# Altium schematic sheet MCU.SchDoc
size A3; PageSetup: Record=PageOptions|CenterHorizontal=True|CenterVertical=True|PrintScale=0.73|XCorrection=1.00|YCorrection=1.00|PrintKind=0|BorderSize=5000000|LeftOffset=0|BottomOffset=0|Orientation=2|PaperLength=1000|PaperWidth=1000|Scale=100|PaperSource=7|PrintQuality=-3|MediaType=1|DitherType=10|PrintScaleMode=1|PaperKind=A4|PaperIndex=9
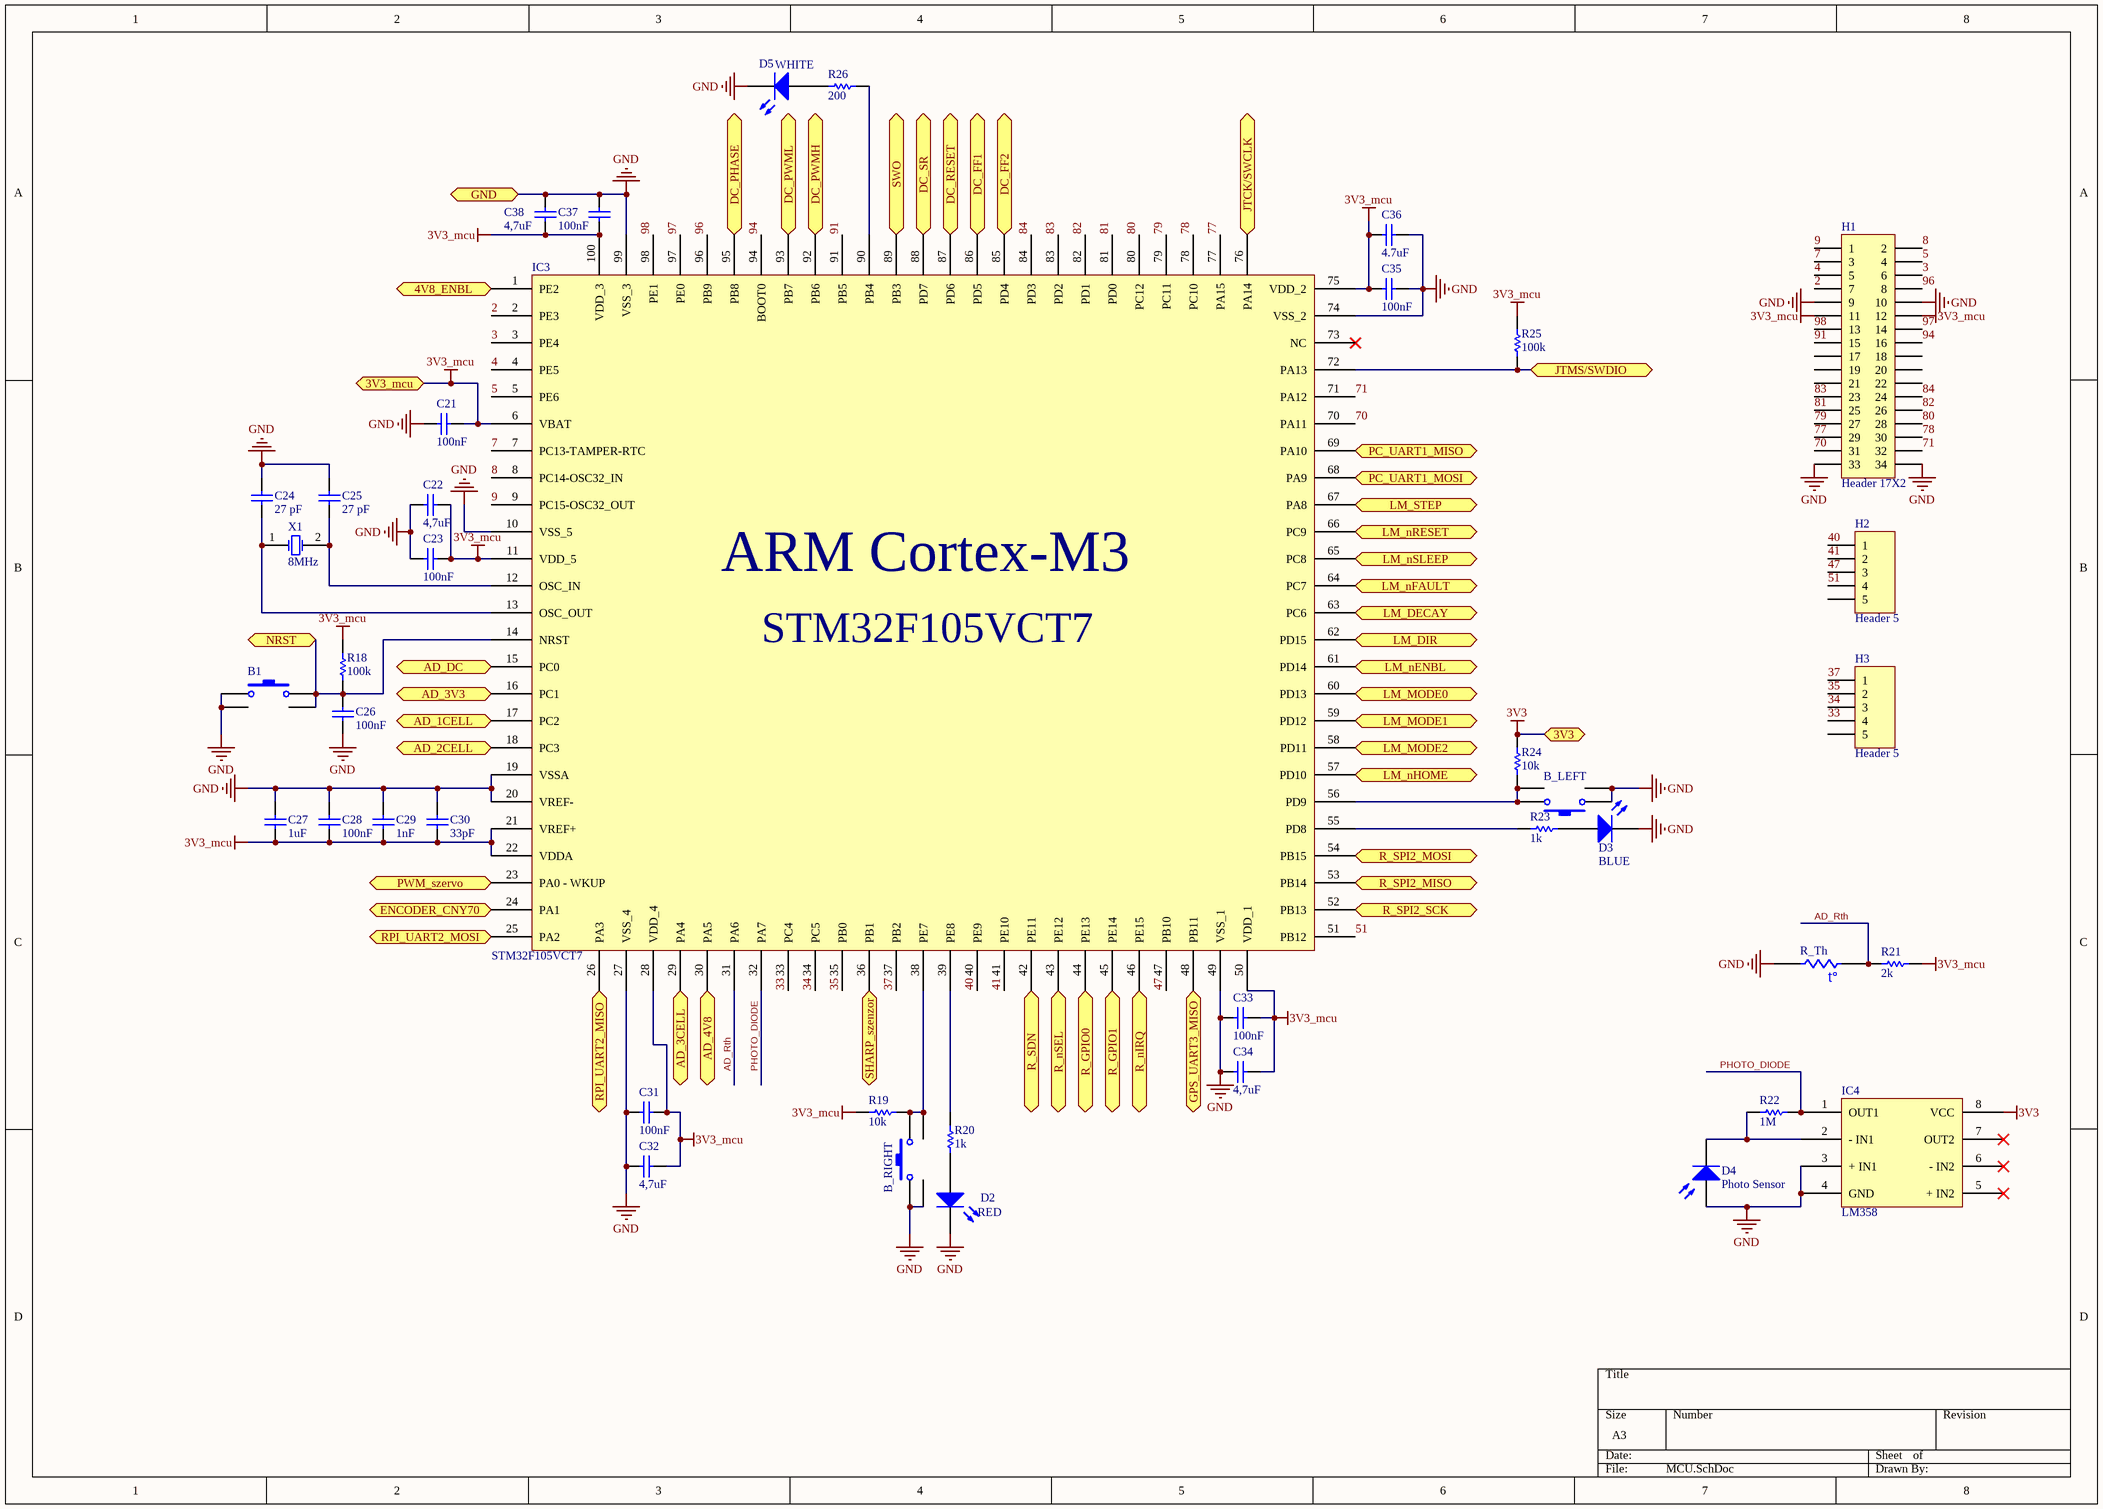
[diagram p0: MCU.SchDoc]

## Parts
B1  SW-PB  [6x6 button]  (value not drawn)
B_LEFT  SW-PB  [6x6 button]  (value not drawn)
B_RIGHT  SW-PB  [6x6 button]  (value not drawn)
C21  value 100nF  [FP_0603_CAP_080]  (hidden comment: Cap)
C22  value 4,7uF  [FP_0603_CAP_080]  (hidden comment: Cap)
C23  value 100nF  [FP_0603_CAP_080]  (hidden comment: Cap)
C24  value 27 pF  [FP_0603_CAP_080]  (hidden comment: Cap)
C25  value 27 pF  [FP_0603_CAP_080]  (hidden comment: Cap)
C26  value 100nF  [FP_0603_CAP_080]  (hidden comment: Cap)
C27  value 1uF  [FP_0603_CAP_080]  (hidden comment: Cap)
C28  value 100nF  [FP_0603_CAP_080]  (hidden comment: Cap)
C29  value 1nF  [FP_0603_CAP_080]  (hidden comment: Cap)
C30  value 33pF  [FP_0603_CAP_080]  (hidden comment: Cap)
C31  value 100nF  [FP_0603_CAP_080]  (hidden comment: Cap)
C32  value 4,7uF  [FP_0603_CAP_080]  (hidden comment: Cap)
C33  value 100nF  [FP_0603_CAP_080]  (hidden comment: Cap)
C34  value 4,7uF  [FP_0603_CAP_080]  (hidden comment: Cap)
C35  value 100nF  [FP_0603_CAP_080]  (hidden comment: Cap)
C36  value 4.7uF  [FP_0603_CAP_080]  (hidden comment: Cap)
C37  value 100nF  [FP_0603_CAP_080]  (hidden comment: Cap)
C38  value 4,7uF  [FP_0603_CAP_080]  (hidden comment: Cap)
D2  RED  [FP_1206_CAP_085]
D3  BLUE  [FP_1206_CAP_085]
D4  Photo Sensor  [FP_CONN2_TUSKE_254MM]
D5  WHITE  [FP_CONN2_TUSKE_254MM]
H1  Header 17X2  [HDR2X17]
H2  Header 5  [HDR1X5]
H3  Header 5  [HDR1X5]
IC3  STM32F105VCT7
IC4  LM358  [SO-8_M]
R18  value 100k  [FP_0603_RES]  (hidden comment: Res Semi)
R19  value 10k  [FP_0603_RES]  (hidden comment: Res Semi)
R20  value 1k  [FP_0603_RES]  (hidden comment: Res1)
R21  value 2k  [FP_0603_RES]  (hidden comment: Res1)
R22  value 1M  [FP_0603_RES]  (hidden comment: Res1)
R23  value 1k  [FP_0603_RES]  (hidden comment: Res1)
R24  value 10k  [FP_0603_RES]  (hidden comment: Res Semi)
R25  value 100k  [FP_0603_RES]  (hidden comment: Res Semi)
R26  value 200  [FP_0603_RES]  (hidden comment: Res1)
R_Th  Res Thermal  [HDR1X3]  (value not drawn)
X1  8MHz  [crystal_furatszerelt]

## Ports
3V3, 3V3_mcu, 4V8_ENBL (out), AD_1CELL (in), AD_2CELL (in), AD_3CELL (in), AD_3V3 (in), AD_4V8 (in), AD_DC (in), DC_FF1 (in), DC_FF2 (in), DC_PHASE (out), DC_PWMH (out), DC_PWML (out), DC_RESET (out), DC_SR (out), ENCODER_CNY70 (in), GND, GPS_UART3_MISO (in), JTCK/SWCLK (bidir), JTMS/SWDIO (bidir), LM_DECAY (out), LM_DIR (out), LM_MODE0 (out), LM_MODE1 (out), LM_MODE2 (out), LM_nENBL (out), LM_nFAULT (in), LM_nHOME (in), LM_nRESET (out), LM_nSLEEP (out), LM_STEP (out), NRST (bidir), PC_UART1_MISO (in), PC_UART1_MOSI (out), PWM_szervo (out), R_GPIO0 (bidir), R_GPIO1 (bidir), R_nIRQ (in), R_nSEL (out), R_SDN (out), R_SPI2_MISO (in), R_SPI2_MOSI (out), R_SPI2_SCK (out), RPI_UART2_MISO (in), RPI_UART2_MOSI (out), SHARP_szenzor (in), SWO (bidir)

## Nets
3V3: IC4.8(VCC) R24.1 ; port 3V3
3V3_mcu: C21.1 C22.1 C23.1 C27.2 C28.2 C29.2 C30.2 C31.1 C32.1 C33.1 C34.1 C35.1 C36.1 C37.1 C38.2 H1.11 H1.12 IC3.6(VBAT) IC3.11(VDD_5) IC3.21(VREF+) IC3.22(VDDA) IC3.28(VDD_4) IC3.50(VDD_1) IC3.75(VDD_2) IC3.100(VDD_3) R18.1 R19.2 R21.1 R25.2 ; port 3V3_mcu
GND: B1.1 B_LEFT.1 B_RIGHT.1 C21.2 C22.2 C23.2 C24.1 C25.1 C26.1 C27.1 C28.1 C29.1 C30.1 C31.2 C32.2 C33.2 C34.2 C35.2 C36.2 C37.2 C38.1 D2.2(K) D3.2(K) D4.1(A) D5.2(K) H1.9 H1.10 H1.33 H1.34 IC3.10(VSS_5) IC3.19(VSSA) IC3.20(VREF-) IC3.27(VSS_4) IC3.49(VSS_1) IC3.74(VSS_2) IC3.99(VSS_3) IC4.3(+_IN1) IC4.4(GND) R_Th.3 ; port GND
2: H1.7 IC3.2(PE3)
3: H1.6 IC3.3(PE4)
4: H1.5 IC3.4(PE5)
4V8_ENBL: IC3.1(PE2) ; port 4V8_ENBL
5: H1.4 IC3.5(PE6)
7: H1.3 IC3.7(PC13-TAMPER-RTC)
8: H1.2 IC3.8(PC14-OSC32_IN)
9: H1.1 IC3.9(PC15-OSC32_OUT)
33: H3.4 IC3.33(PC4)
34: H3.3 IC3.34(PC5)
35: H3.2 IC3.35(PB0)
37: H3.1 IC3.37(PB2)
40: H2.1 IC3.40(PE9)
41: H2.2 IC3.41(PE10)
47: H2.3 IC3.47(PB10)
51: H2.4 IC3.51(PB12)
70: H1.31 IC3.70(PA11)
71: H1.32 IC3.71(PA12)
77: H1.29 IC3.77(PA15)
78: H1.30 IC3.78(PC10)
79: H1.27 IC3.79(PC11)
80: H1.28 IC3.80(PC12)
81: H1.25 IC3.81(PD0)
82: H1.26 IC3.82(PD1)
83: H1.23 IC3.83(PD2)
84: H1.24 IC3.84(PD3)
91: H1.15 IC3.91(PB5)
94: H1.16 IC3.94(BOOT0)
96: H1.8 IC3.96(PB9)
97: H1.14 IC3.97(PE0)
98: H1.13 IC3.98(PE1)
AD_1CELL: IC3.17(PC2) ; port AD_1CELL
AD_2CELL: IC3.18(PC3) ; port AD_2CELL
AD_3CELL: IC3.29(PA4) ; port AD_3CELL
AD_3V3: IC3.16(PC1) ; port AD_3V3
AD_4V8: IC3.30(PA5) ; port AD_4V8
AD_DC: IC3.15(PC0) ; port AD_DC
AD_Rth: IC3.31(PA6) R21.2 R_Th.1
DC_FF1: IC3.86(PD5) ; port DC_FF1
DC_FF2: IC3.85(PD4) ; port DC_FF2
DC_PHASE: IC3.95(PB8) ; port DC_PHASE
DC_PWMH: IC3.92(PB6) ; port DC_PWMH
DC_PWML: IC3.93(PB7) ; port DC_PWML
DC_RESET: IC3.87(PD6) ; port DC_RESET
DC_SR: IC3.88(PD7) ; port DC_SR
ENCODER_CNY70: IC3.24(PA1) ; port ENCODER_CNY70
GPS_UART3_MISO: IC3.48(PB11) ; port GPS_UART3_MISO
JTCK/SWCLK: IC3.76(PA14) ; port JTCK/SWCLK
JTMS/SWDIO: IC3.72(PA13) R25.1 ; port JTMS/SWDIO
LM_DECAY: IC3.63(PC6) ; port LM_DECAY
LM_DIR: IC3.62(PD15) ; port LM_DIR
LM_MODE0: IC3.60(PD13) ; port LM_MODE0
LM_MODE1: IC3.59(PD12) ; port LM_MODE1
LM_MODE2: IC3.58(PD11) ; port LM_MODE2
LM_nENBL: IC3.61(PD14) ; port LM_nENBL
LM_nFAULT: IC3.64(PC7) ; port LM_nFAULT
LM_nHOME: IC3.57(PD10) ; port LM_nHOME
LM_nRESET: IC3.66(PC9) ; port LM_nRESET
LM_nSLEEP: IC3.65(PC8) ; port LM_nSLEEP
LM_STEP: IC3.67(PA8) ; port LM_STEP
NRST: B1.2 C26.2 IC3.14(NRST) R18.2 ; port NRST
PC_UART1_MISO: IC3.69(PA10) ; port PC_UART1_MISO
PC_UART1_MOSI: IC3.68(PA9) ; port PC_UART1_MOSI
PHOTO_DIODE: IC3.32(PA7) IC4.1(OUT1) R22.2
PWM_szervo: IC3.23(PA0_-_WKUP) ; port PWM_szervo
R_GPIO0: IC3.44(PE13) ; port R_GPIO0
R_GPIO1: IC3.45(PE14) ; port R_GPIO1
R_nIRQ: IC3.46(PE15) ; port R_nIRQ
R_nSEL: IC3.43(PE12) ; port R_nSEL
R_SDN: IC3.42(PE11) ; port R_SDN
R_SPI2_MISO: IC3.53(PB14) ; port R_SPI2_MISO
R_SPI2_MOSI: IC3.54(PB15) ; port R_SPI2_MOSI
R_SPI2_SCK: IC3.52(PB13) ; port R_SPI2_SCK
RPI_UART2_MISO: IC3.26(PA3) ; port RPI_UART2_MISO
RPI_UART2_MOSI: IC3.25(PA2) ; port RPI_UART2_MOSI
SHARP_szenzor: IC3.36(PB1) ; port SHARP_szenzor
SWO: IC3.89(PB3) ; port SWO
NetB_LEFT_2: B_LEFT.2 IC3.56(PD9) R24.2
NetB_RIGHT_2: B_RIGHT.2 IC3.38(PE7) R19.1
NetC24_2: C24.2 IC3.13(OSC_OUT) X1.1(OSC1)
NetC25_2: C25.2 IC3.12(OSC_IN) X1.2(OSC2)
NetD2_1: D2.1(A) R20.2
NetD3_1: D3.1(A) R23.1
NetD4_2: D4.2(K) IC4.2(-_IN1) R22.1
NetD5_1: D5.1(A) R26.1
NetIC3_39: IC3.39(PE8) R20.1
NetIC3_55: IC3.55(PD8) R23.2
NetIC3_90: IC3.90(PB4) R26.2

Not connected (* = marked no-connect by the designer): H1 17 18 19 20 21 22; H2 5; H3 5; IC3 73(NC)*; IC4 5(+_IN2)* 6(-_IN2)* 7(OUT2)*

## Notes on the sheet
- (in symbol Res Thermal) t°
- (in symbol STM32F105xx) ARM Cortex-M3

## Library data of the parts
B1 B_LEFT B_RIGHT = SW-PB: Switch; Published: 24-Mar-1999; LatestRevisionDate: 17-Jul-2002; LatestRevisionNote: Re-released for DXP Platform.; PackageReference: SPST-2; Publisher: Altium Limited; PackageDescription: Switch; 2 Leads
C21-C38 = Cap: Capacitor; Published: 8-Jun-2000; LatestRevisionDate: 17-Jul-2002; LatestRevisionNote: Re-released for DXP Platform.; PackageReference: RAD-0.3; Publisher: Altium Limited; PackageDescription: Radial Cap, Thru-Hole; 2 Leads; 0.3 in Pin Spacing
D2 D3 D5 = LED0: Typical INFRARED GaAs LED; Published: 8-Jun-2000; LatestRevisionDate: 08-Jul-2005; LatestRevisionNote: Mech Layer 1 removed.; PackageReference: LED-0; Publisher: Altium Limited; PackageDescription: LED; 2 Leads
D4 = Photo Sen: Photosensitive Diode; Published: 24-Mar-1999; LatestRevisionDate: 17-Jul-2002; LatestRevisionNote: Re-released for DXP Platform.; PackageReference: PIN2; Publisher: Altium Limited
H1 = Header 17X2: Header, 17-Pin, Dual row; LatestRevisionDate: 17-Jul-2002; LatestRevisionNote: Re-released for DXP Platform.; Publisher: Altium Limited
H2 H3 = Header 5: Header, 5-Pin; LatestRevisionDate: 17-Jul-2002; LatestRevisionNote: Re-released for DXP Platform.; Publisher: Altium Limited
IC3 = STM32F105xx
R18 R19 R24 R25 = Res Semi: Semiconductor Resistor; Published: 8-Jun-2000; LatestRevisionDate: 17-Jul-2002; LatestRevisionNote: Re-released for DXP Platform.; PackageReference: AXIAL-0.5; Publisher: Altium Limited; PackageDescription: Axial Device, Thru-Hole; 2 Leads; 0.5 in Pin Spacing
R20-R23 R26 = Res1: Resistor; Published: 8-Jun-2000; LatestRevisionDate: 17-Jul-2002; LatestRevisionNote: Re-released for DXP Platform.; PackageReference: AXIAL-0.3; Publisher: Altium Limited; PackageDescription: Axial Device, Thru-Hole; 2 Leads; 0.3 in Pin Spacing
R_Th = Res Thermal: Thermistor; Published: 24-Mar-1999; LatestRevisionDate: 29-May-2009; LatestRevisionNote: IPC-7351 Footprint Added.; PackageVersion: Mar-2003; PackageReference: 6-0805; Publisher: Altium Limited; PackageDescription: Chip Resistor 0805 Case Size; Code_IPC: RESC2012
X1 = XTAL: Crystal Oscillator; Published: 8-Jun-2000; LatestRevisionDate: 17-Jul-2002; LatestRevisionNote: Re-released for DXP Platform.; PackageReference: R38; Publisher: Altium Limited; PackageDescription: Crystal, Thru-Hole; 2 Leads; Body 3.1 x 8.2 mm (Dia.xH)